# Altium project MB1419.PrjPcb
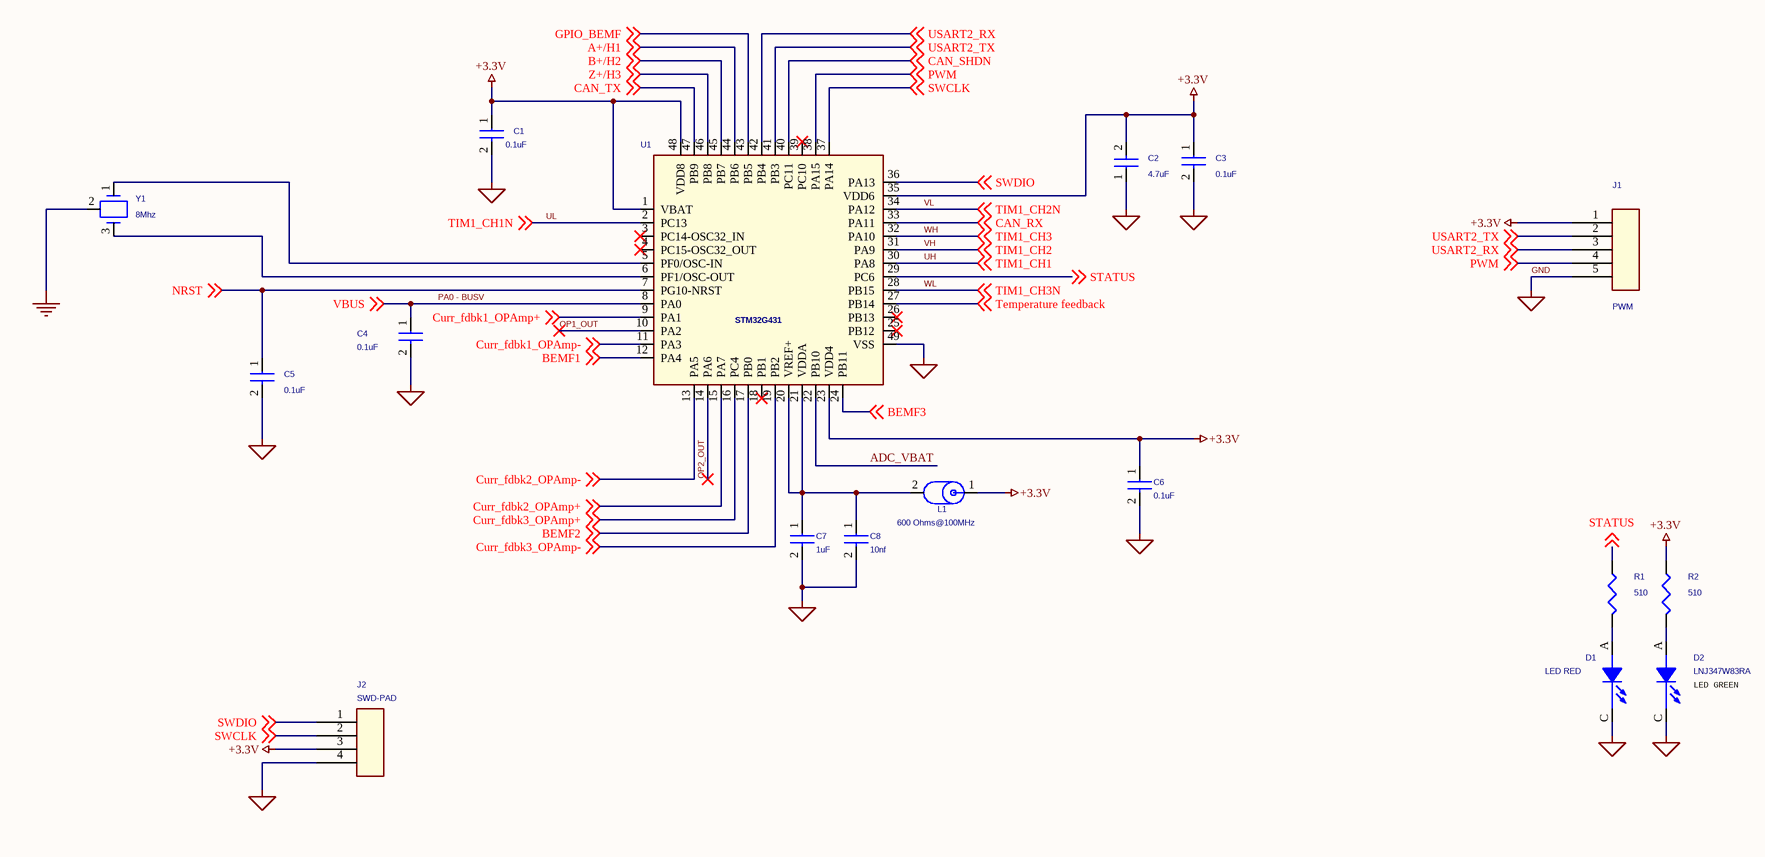
[diagram p0: MCU.SchDoc]
Board_Assembly_Revision: 01; Board_Document_Date: 26-MARCH-2019; Board_Name: ESC_G4; Board_PCB_Revision: B; Board_Reference: MB1419
4 sheets, 121 parts. Net scope: global (net labels, ports and power ports of the same name join across sheets).
Board file: MB1419.PcbDoc
Sheets:
  MCU.SchDoc
  POWER STAGE.SchDoc
  SENSING.SchDoc
  CAN.SchDoc

## Sheet MCU.SchDoc: MVU
size A3; DocumentNumber: 4; SheetNumber: 4; SheetTotal: 6

### Parts
C1  0.1uF  [C_0402]
C2  4.7uF  [C_0603]
C3  0.1uF  [C_0402]
C4  0.1uF  [C_0402]
C5  0.1uF  [C_0402]
C6  0.1uF  [C_0402]
C7  1uF  [C_0402]
C8  10nf  [C_0402]
D1  LED RED  [D_0402_Led_red]
D2  LNJ347W83RA  [D_0402_Led_green]
J1  PWM  [SOLDER_PAD_5PIN_SMD]
J2  SWD-PAD  [SOLDER_PAD_4PIN_rect_SMD]
L1  600 Ohms@100MHz  [L_0402]
R1  510  [R_0402]
R2  510  [R_0402]
U1  STM32G431  [qfn49p50_700x700x60l40x25t560n]
Y1  8Mhz  [murata_cstce8m00g15c99-r0]

### Nets
+3.3V: C1.1 C2.2 C3.1 C6.1 J1.1 J2.3 L1.1 R2.1 U1.1(VBAT) U1.23(VDD4) U1.35(VDD6) U1.48(VDD8)
GND: C1.2 C2.1 C3.2 C4.2 C5.2 C6.2 C7.2 C8.2 D1.C(CATHODE) D2.C(CATHODE) J1.5 J2.4 U1.49(VSS) Y1.2  [also labelled GND_SIGNAL]
A+/H1: U1.44(PB6) ; off-sheet A+/H1
ADC_VBAT: U1.22(PB10)
B+/H2: U1.45(PB7) ; off-sheet B+/H2
BEMF1: U1.12(PA4) ; off-sheet BEMF1
BEMF2: U1.17(PB0) ; off-sheet BEMF2
BEMF3: U1.24(PB11) ; off-sheet BEMF3
CAN_RX: U1.33(PA11) ; off-sheet CAN_RX
CAN_SHDN: U1.40(PC11) ; off-sheet CAN_SHDN
CAN_TX: U1.47(PB9) ; off-sheet CAN_TX
Curr_fdbk1_OPAmp+: U1.9(PA1) ; off-sheet Curr_fdbk1_OPAmp+
Curr_fdbk1_OPAmp-: U1.11(PA3) ; off-sheet Curr_fdbk1_OPAmp-
Curr_fdbk2_OPAmp+: U1.15(PA7) ; off-sheet Curr_fdbk2_OPAmp+
Curr_fdbk2_OPAmp-: U1.13(PA5) ; off-sheet Curr_fdbk2_OPAmp-
Curr_fdbk3_OPAmp+: U1.16(PC4) ; off-sheet Curr_fdbk3_OPAmp+
Curr_fdbk3_OPAmp-: U1.19(PB2) ; off-sheet Curr_fdbk3_OPAmp-
GPIO_BEMF: U1.43(PB5) ; off-sheet GPIO_BEMF
NRST: C5.1 U1.7(PG10-NRST) ; off-sheet NRST
OP1_OUT: U1.10(PA2)
OP2_OUT: U1.14(PA6)
PA0 - BUSV: C4.1 U1.8(PA0) ; off-sheet VBUS  [also labelled VBUS]
PWM: J1.4 U1.38(PA15) ; off-sheet PWM
STATUS: R1.1 U1.29(PC6) ; off-sheet STATUS
SWCLK: J2.2 U1.37(PA14) ; off-sheet SWCLK
SWDIO: J2.1 U1.36(PA13) ; off-sheet SWDIO
Temperature feedback: U1.27(PB14) ; off-sheet Temperature feedback
UH: U1.30(PA8) ; off-sheet TIM1_CH1  [also labelled TIM1_CH1]
UL: U1.2(PC13) ; off-sheet TIM1_CH1N  [also labelled TIM1_CH1N]
USART2_RX: J1.3 U1.42(PB4) ; off-sheet USART2_RX
USART2_TX: J1.2 U1.41(PB3) ; off-sheet USART2_TX
VH: U1.31(PA9) ; off-sheet TIM1_CH2  [also labelled TIM1_CH2]
VL: U1.34(PA12) ; off-sheet TIM1_CH2N  [also labelled TIM1_CH2N]
WH: U1.32(PA10) ; off-sheet TIM1_CH3  [also labelled TIM1_CH3]
WL: U1.28(PB15) ; off-sheet TIM1_CH3N  [also labelled TIM1_CH3N]
Z+/H3: U1.46(PB8) ; off-sheet Z+/H3
NetC7_1: C7.1 C8.1 L1.2 U1.20(VREF+) U1.21(VDDA)
NetD1_A: D1.A(ANODE) R1.2
NetD2_A: D2.A(ANODE) R2.2
NetU1_5: U1.5(PF0/OSC-IN) Y1.1
NetU1_6: U1.6(PF1/OSC-OUT) Y1.3

Not connected (* = marked no-connect by the designer): U1 3(PC14-OSC32_IN)* 4(PC15-OSC32_OUT)* 18(PB1)* 25(PB12)* 26(PB13)* 39(PC10)*

### Notes on the sheet
- (near D2) LED GREEN
- Title:
- Project:
- Size:
- Revision:
- Variant:
- A3
- -
- Date:
- Reference:
- Sheet:
- of

### Library data of the parts
C1 = CAP_Dup1: CAP CER 0.1UF 16V X7R 0402; PART_NUMBER: CAP-00000053; Manufacturer: Wurth Electronics Inc.; Manufacturer PN: 885012205037; Dielectric Type: Capacitors; Tolerance: 10%; CLASS: DISCRETE; Package Size: 0402 (1005 Metric); Temperature Coefficient: X7R; Rated Voltage: 16V
C2 = CAP_Dup1: CAP CER 4.7UF 10V X5R 0603; Manufacturer PN: 885012106012; Manufacturer: Wurth Electronics Inc.; PART_NUMBER: TMP-414; CLASS: DISCRETE; Tolerance: 20%; Dielectric Type: Capacitors; Rated Voltage: 10V; Temperature Coefficient: X5R; Package Size: 0603 (1608 Metric)
C3-C6 = CAP_Dup1: CAP CER 0.1UF 16V X7R 0402; Manufacturer PN: 885012205037; Manufacturer: Wurth Electronics Inc.; PART_NUMBER: CAP-00000053; CLASS: DISCRETE; Tolerance: 10%; Dielectric Type: Capacitors; Rated Voltage: 16V; Temperature Coefficient: X7R; Package Size: 0402 (1005 Metric)
C7 = CAP_Dup1: CAP CER 1UF 25V X5R 0402; PART_NUMBER: CAP-00000006; Manufacturer: Murata Electronics North America; Manufacturer PN: GRM155R61E105KA12D; Dielectric Type: Capacitors; Tolerance: 10%; CLASS: DISCRETE; Package Size: 0402 (1005 Metric); Temperature Coefficient: X5R; Rated Voltage: 25V
C8 = CAP_Dup1: CAP CER 10000PF 16V X7R 0402; PART_NUMBER: TMP-422; Manufacturer: Wurth Electronics Inc.; Manufacturer PN: 885012205031; Dielectric Type: Capacitors; Tolerance: 10%; CLASS: DISCRETE; Package Size: 0402 (1005 Metric); Temperature Coefficient: X7R; Rated Voltage: 16V
D1 = LED: DIO, Rectangle with Flat Top, 1.00mm x 0.50mm, VLMS1500-GS08, 20mA, --, --, 0402 (1005 Metric); PART_NUMBER: DIO-00000003; Manufacturer: Vishay Semiconductor Opto Division; CLASS: DISCRETE; Package Size: 0402 (1005 Metric); Manufacturer PN: VLMS1500-GS08
D2 = LED: LED GREEN 0402 SMD; PART_NUMBER: TMP-187; Manufacturer: Panasonic Electronic Components; CLASS: DISCRETE; Package Size: 0402 (1005 Metric); Manufacturer PN: LNJ347W83RA
J1 = CON5: SOLDER PADS
J2 = CON4: SOLDER PADS
L1 = IND_FB: FERRITE BEAD 600 OHM 0402 1LN; Manufacturer PN: BLM15BX601SN1D; Manufacturer: Murata Electronics North America; PART_NUMBER: TMP-492; CLASS: DISCRETE; Package Size: 0402 (1005 Metric)
R1 R2 = RES: RES SMD 510 OHM 1% 1/16W 0402; PART_NUMBER: TMP-438; Manufacturer: Yageo; Manufacturer PN: RC0402FR-07510RL; Temperature Coefficient: 100ppm/C; Rated Power: 0.063W, 1/16W; CLASS: DISCRETE; Package Size: 0402 (1005 Metric); Tolerance: 1%
U1 = STM32_LQFP64_6
Y1 = resonator: CER RES 8.0000MHZ 33PF SMD; Manufacturer PN: CSTCE8M00G15C99-R0; Manufacturer: Murata Electronics North America; PART_NUMBER: TMP-382; CLASS: DISCRETE; Frequency Tolerance: 0.1%; Frequency Stability: 0.13%; Package Size: 0.126" L x 0.051" W (3.20mm x 1.30mm)

## Sheet POWER STAGE.SchDoc: POWER STAGE
size A3; DocumentNumber: 5; SheetNumber: 5; SheetTotal: 6
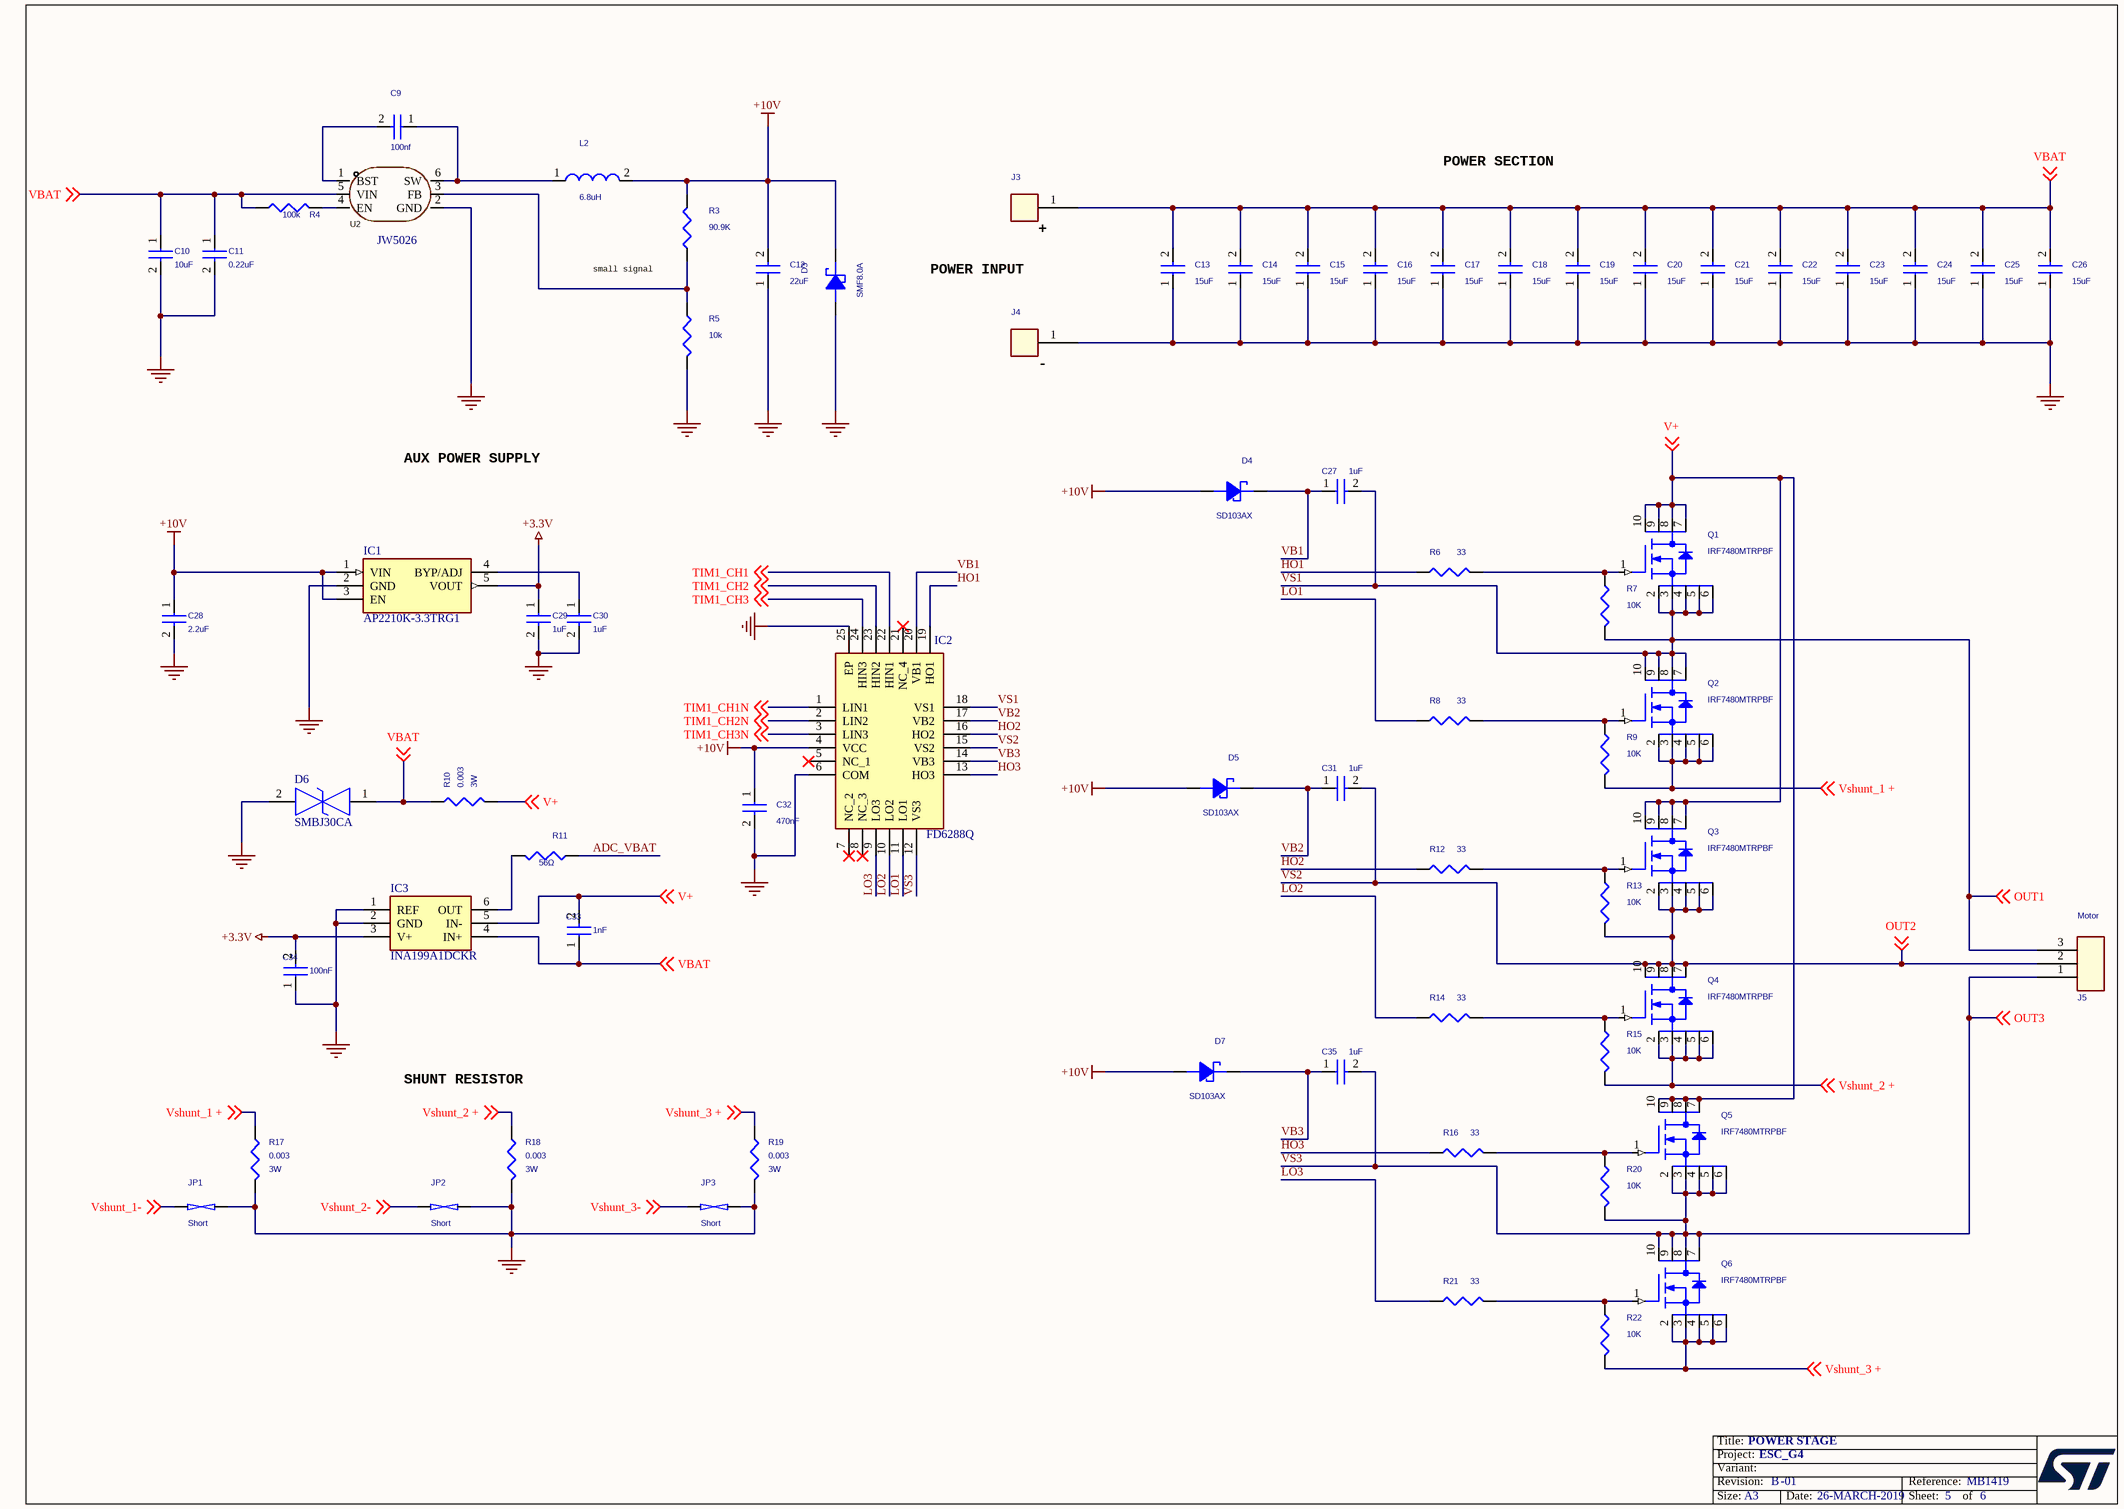
[diagram p1: POWER STAGE.SchDoc]

### Parts
C9  100nf  [C_0402]
C10  10uF  [C_1206]
C11  0.22uF  [C_0603_HD]
C12  22uF  [C_1206]
C13  15uF  [C_0805_HD]
C14  15uF  [C_0805_HD]
C15  15uF  [C_0805_HD]
C16  15uF  [C_0805_HD]
C17  15uF  [C_0805_HD]
C18  15uF  [C_0805_HD]
C19  15uF  [C_0805_HD]
C20  15uF  [C_0805_HD]
C21  15uF  [C_0805_HD]
C22  15uF  [C_0805_HD]
C23  15uF  [C_0805_HD]
C24  15uF  [C_0805_HD]
C25  15uF  [C_0805_HD]
C26  15uF  [C_0805_HD]
C27  1uF  [C_0402]
C28  2.2uF  [C_0402]
C29  1uF  [C_0402]
C30  1uF  [C_0402]
C31  1uF  [C_0402]
C32  470nF  [C_0603_HD]
C33  1nF  [C_0402]
C34  100nF  [C_0402]
C35  1uF  [C_0402]
D3  SMF8.0A  [SODFL3618X108N]
D4  SD103AX  [SODFL1608X70N]
D5  SD103AX  [SODFL1608X70N]
D6  SMBJ30CA  [SMBJ50CA]
D7  SD103AX  [SODFL1608X70N]
IC1  AP2210K-3.3TRG1  [SOT95P280X145-5N]
IC2  FD6288Q  [QFN50P400X400X90-25N-D]
IC3  INA199A1DCKR  [SOT65P210X110-6N]
J3  CON1  [wire1_220s]  (value not drawn)
J4  CON1  [wire1_220s]  (value not drawn)
J5  Motor  [conn_motor_out]
JP1  Short  [SHORT]
JP2  Short  [SHORT]
JP3  Short  [SHORT]
L2  6.8uH  [LQM2MPN1R0NG0L]
Q1  IRF7480MTRPBF  [IRF7480MTRPBF]
Q2  IRF7480MTRPBF  [IRF7480MTRPBF]
Q3  IRF7480MTRPBF  [IRF7480MTRPBF]
Q4  IRF7480MTRPBF  [IRF7480MTRPBF]
Q5  IRF7480MTRPBF  [IRF7480MTRPBF]
Q6  IRF7480MTRPBF  [IRF7480MTRPBF]
R3  90.9K  [R_0402]
R4  100k  [R_0402]
R5  10k  [R_0402]
R6  33  [R_0402]
R7  10K  [R_0402]
R8  33  [R_0402]
R9  10K  [R_0402]
R10  0.003  Rated Power: 3W  [resc635x300x60l193n]
R11  56Ω  [R_0402]
R12  33  [R_0402]
R13  10K  [R_0402]
R14  33  [R_0402]
R15  10K  [R_0402]
R16  33  [R_0402]
R17  0.003  Rated Power: 3W  [resc635x300x60l193n]
R18  0.003  Rated Power: 3W  [resc635x300x60l193n]
R19  0.003  Rated Power: 3W  [resc635x300x60l193n]
R20  10K  [R_0402]
R21  33  [R_0402]
R22  10K  [R_0402]
U2  JW5026  [SOT-23-6_L2.9-W1.6-P0.95-LS2.8-BR]

### Nets
+3.3V: C29.1 C34.2 IC1.5(VOUT) IC3.3(V+)
+10V: C12.2 C28.1 C32.1 D3.C D4.A D5.A D7.A IC1.1(VIN) IC1.3(EN) IC2.4(VCC) L2.2 R3.1
GND: C10.2 C11.2 C12.1 C13.1 C14.1 C15.1 C16.1 C17.1 C18.1 C19.1 C20.1 C21.1 C22.1 C23.1 C24.1 C25.1 C26.1 C28.2 C29.2 C30.2 C32.2 C34.1 D3.A D6.2 IC1.2(GND) IC2.6(COM) IC2.25(EP) IC3.1(REF) IC3.2(GND) J4.1 JP1.2 JP2.2 JP3.2 R5.1 R17.2 R18.2 R19.2 U2.2(GND)
ADC_VBAT: R11.1
HO1: IC2.19(HO1) R6.1
HO2: IC2.16(HO2) R12.1
HO3: IC2.13(HO3) R16.1
LO1: IC2.11(LO1) R8.1
LO2: IC2.10(LO2) R14.1
LO3: IC2.9(LO3) R21.1
TIM1_CH1: IC2.22(HIN1) ; off-sheet TIM1_CH1  [project net UH]
TIM1_CH1N: IC2.1(LIN1) ; off-sheet TIM1_CH1N  [project net UL]
TIM1_CH2: IC2.23(HIN2) ; off-sheet TIM1_CH2  [project net VH]
TIM1_CH2N: IC2.2(LIN2) ; off-sheet TIM1_CH2N  [project net VL]
TIM1_CH3: IC2.24(HIN3) ; off-sheet TIM1_CH3  [project net WH]
TIM1_CH3N: IC2.3(LIN3) ; off-sheet TIM1_CH3N  [project net WL]
V+: C33.2 IC3.5(IN-) Q1.7(D7) Q1.8(D8) Q1.9(D9) Q1.10(D10) Q3.7(D7) Q3.8(D8) Q3.9(D9) Q3.10(D10) Q5.7(D7) Q5.8(D8) Q5.9(D9) Q5.10(D10) R10.2 ; off-sheet V+
VB1: C27.1 D4.C IC2.20(VB1)
VB2: C31.1 D5.C IC2.17(VB2)
VB3: C35.1 D7.C IC2.14(VB3)
VBAT: C10.1 C11.1 C13.2 C14.2 C15.2 C16.2 C17.2 C18.2 C19.2 C20.2 C21.2 C22.2 C23.2 C24.2 C25.2 C26.2 C33.1 D6.1 IC3.4(IN+) J3.1 R4.2 R10.1 U2.5(VIN) ; off-sheet VBAT
VS1: C27.2 IC2.18(VS1) J5.3 Q1.2(S1) Q1.3(S2) Q1.4(S3) Q1.5(S4) Q1.6(S5) Q2.7(D7) Q2.8(D8) Q2.9(D9) Q2.10(D10) R7.2 ; off-sheet OUT1  [also labelled OUT1]
VS2: C31.2 IC2.15(VS2) J5.2 Q3.2(S1) Q3.3(S2) Q3.4(S3) Q3.5(S4) Q3.6(S5) Q4.7(D7) Q4.8(D8) Q4.9(D9) Q4.10(D10) R13.2 ; off-sheet OUT2  [also labelled OUT2]
VS3: C35.2 IC2.12(VS3) J5.1 Q5.2(S1) Q5.3(S2) Q5.4(S3) Q5.5(S4) Q5.6(S5) Q6.7(D7) Q6.8(D8) Q6.9(D9) Q6.10(D10) R20.2 ; off-sheet OUT3  [also labelled OUT3]
Vshunt_1 +: Q2.2(S1) Q2.3(S2) Q2.4(S3) Q2.5(S4) Q2.6(S5) R9.2 R17.1 ; off-sheet Vshunt_1 +
Vshunt_1-: JP1.1 ; off-sheet Vshunt_1-  [project net Curr_fdbk1_OPAmp-]
Vshunt_2 +: Q4.2(S1) Q4.3(S2) Q4.4(S3) Q4.5(S4) Q4.6(S5) R15.2 R18.1 ; off-sheet Vshunt_2 +
Vshunt_2-: JP2.1 ; off-sheet Vshunt_2-  [project net Curr_fdbk2_OPAmp-]
Vshunt_3 +: Q6.2(S1) Q6.3(S2) Q6.4(S3) Q6.5(S4) Q6.6(S5) R19.1 R22.2 ; off-sheet Vshunt_3 +
Vshunt_3-: JP3.1 ; off-sheet Vshunt_3-  [project net Curr_fdbk3_OPAmp-]
NetC9_1: C9.1 L2.1 U2.6(SW)
NetC9_2: C9.2 U2.1(BST)
NetC30_1: C30.1 IC1.4(BYP/ADJ)
NetIC3_6: IC3.6(OUT) R11.2
NetQ1_1: Q1.1(G) R6.2 R7.1
NetQ2_1: Q2.1(G) R8.2 R9.1
NetQ3_1: Q3.1(G) R12.2 R13.1
NetQ4_1: Q4.1(G) R14.2 R15.1
NetQ5_1: Q5.1(G) R16.2 R20.1
NetQ6_1: Q6.1(G) R21.2 R22.1
NetR3_2: R3.2 R5.2 U2.3(FB)
NetR4_1: R4.1 U2.4(EN)

Not connected (* = marked no-connect by the designer): IC2 5(NC_1)* 7(NC_2)* 8(NC_3)* 21(NC_4)*

### Notes on the sheet
- POWER SECTION
- (near J3) +
- small signal
- POWER INPUT
- (near J4) -
- AUX POWER SUPPLY
- (near R18) SHUNT RESISTOR
- Title:
- Project:
- Size:
- Revision:
- Variant:
- A3
- Date:
- Reference:
- Sheet:
- of

### Library data of the parts
C9 = CAP_Dup1: CAP CER 3900PF 16V X7R 0402; Manufacturer PN: C0402C392K4RAC7867; Manufacturer: KEMET; PART_NUMBER: TMP-419; CLASS: DISCRETE; Tolerance: 10%; Dielectric Type: Capacitors; Rated Voltage: 16V; Temperature Coefficient: X7R; Package Size: 0402 (1005 Metric)
C10 = CAP_Dup1: CAP CER 10UF 50V X7R 1206; Manufacturer PN: CL31B106KBHNNNE; Manufacturer: Samsung Electro-Mechanics America, Inc.; PART_NUMBER: CAP-00000016; CLASS: DISCRETE; Tolerance: 10%; Dielectric Type: Capacitors; Rated Voltage: 50V; Temperature Coefficient: X7R; Package Size: 1206 (3216 Metric)
C11 = CAP_Dup1: CAP CER 0.22UF 50V X7R 0603; Manufacturer PN: CGA3E3X7R1H224K080AD; Manufacturer: TDK Corporation; PART_NUMBER: TMP-138; CLASS: DISCRETE; Tolerance: 10%; Dielectric Type: Capacitors; Rated Voltage: 50V; Temperature Coefficient: X7R; Package Size: 0603 (1608 Metric); ALT_SYMBOLS: c_0603_hd
C12 = CAP_Dup1: CAP CER 22UF 25V X5R 1206; Manufacturer PN: GRT31CR61E226ME01L; Manufacturer: Murata Electronics North America; PART_NUMBER: TMP-421; CLASS: DISCRETE; Tolerance: 20%; Dielectric Type: Capacitors; Rated Voltage: 25V; Temperature Coefficient: X5R; Package Size: 1206 (3216 Metric)
C13-C26 = CAP_Dup1: CAP CER 15UF 35V X5R 0805; PART_NUMBER: TMP-773; Manufacturer: TDK Corporation; Manufacturer PN: C2012X5R1V156M125AC; Dielectric Type: Capacitors; Tolerance: 20%; CLASS: DISCRETE; ALT_SYMBOLS: C_0805_hd; Package Size: 0805 (2012 Metric); Temperature Coefficient: X5R; Rated Voltage: 35V
C27 C31 C33-C35 = CAP: CAP CER 10PF 10V C0G/NP0 0402; Manufacturer PN: 885012005007; Manufacturer: Wurth Electronics Inc.; PART_NUMBER: TMP-395; CLASS: DISCRETE; Tolerance: 5%; Temperature Coefficient: C0G, NP0; Dielectric Type: Capacitors; Rated Voltage: 10V; Package Size: 0402 (1005 Metric)
C28 = CAP_Dup1: CAP CER 2.2UF 10V X5R 0402; PART_NUMBER: TMP-449; Manufacturer: Wurth Electronics Inc.; Manufacturer PN: 885012105013; Dielectric Type: Capacitors; Tolerance: 20%; CLASS: DISCRETE; Package Size: 0402 (1005 Metric); Temperature Coefficient: X5R; Rated Voltage: 10V
C29 C30 = CAP_Dup1: CAP CER 1UF 25V X5R 0402; Manufacturer PN: GRM155R61E105KA12D; Manufacturer: Murata Electronics North America; PART_NUMBER: CAP-00000006; CLASS: DISCRETE; Tolerance: 10%; Dielectric Type: Capacitors; Rated Voltage: 25V; Temperature Coefficient: X5R; Package Size: 0402 (1005 Metric)
C32 = CAP_Dup1: CAP CER 0.47UF 25V X7R 0603; PART_NUMBER: TMP-428; Manufacturer: Wurth Electronics Inc.; Manufacturer PN: 885012206075; Dielectric Type: Capacitors; Tolerance: 10%; CLASS: DISCRETE; ALT_SYMBOLS: c_0603_hd; Package Size: 0603 (1608 Metric); Temperature Coefficient: X7R; Rated Voltage: 25V
D3 = DIODE_SCHOTTKY_0: DIODE SCHOTTKY 20V 1A STMITEFLAT; PART_NUMBER: TMP-380; Manufacturer: STMicroelectronics; Manufacturer PN: STPS1L20MF; Rated Voltage: 430mV @ 1A; CLASS: DISCRETE; Package Size: DO-222AA
D4 D5 D7 = DIODE_SCHOTTKY_0: DIODE SCHOTTKY 20V 1A STMITEFLAT; Manufacturer PN: STPS1L20MF; Manufacturer: STMicroelectronics; PART_NUMBER: TMP-380; CLASS: DISCRETE; Rated Voltage: 430mV @ 1A; Package Size: DO-222AA
D6 = SMBJ30CA: TVS Diode (Bi-directional); Manufacturer_Name: STMicroelectronics; Datasheet Link: http://www.st.com/web/en/resource/technical/document/datasheet/CD00001366.pdf; Height: 2.65mm; Manufacturer_Part_Number: SMBJ30CA
IC1 = AP2210K-3.3TRG1: Integrated Circuit; Manufacturer_Name: Diodes Inc.; Datasheet Link: https://datasheet.datasheetarchive.com/originals/distributors/Datasheets_SAMA/11c7b06ddc65ce3f1395e62eca004054.pdf; Height: 1.45mm; Manufacturer_Part_Number: AP2210K-3.3TRG1; Mouser Part Number: 621-AP2210K-3.3TRG1; Mouser Price/Stock: https://www.mouser.co.uk/ProductDetail/Diodes-Incorporated/AP2210K-3.3TRG1?qs=x6A8l6qLYDB6QE%252Bu0QG50A%3D%3D; Arrow Part Number: AP2210K-3.3TRG1; Arrow Price/Stock: https://www.arrow.com/en/products/ap2210k-3.3trg1/diodes-incorporated?region=asia
IC2 = FD6288Q: Integrated Circuit; Manufacturer_Name: Fortior Tech; Datasheet Link: https://datasheet.lcsc.com/szlcsc/1811131655_Fortior-Tech-FD6288Q_C328453.pdf; Height: 0.9mm; Manufacturer_Part_Number: FD6288Q
IC3 = INA199A1DCKR: Integrated Circuit; Manufacturer_Name: Texas Instruments; Datasheet Link: http://www.ti.com/lit/ds/symlink/ina199.pdf; Height: 1.1mm; Manufacturer_Part_Number: INA199A1DCKR; Mouser Part Number: 595-INA199A1DCKR; Mouser Price/Stock: https://www.mouser.co.uk/ProductDetail/Texas-Instruments/INA199A1DCKR?qs=v3hU%2FV0XOahkyIKIBScY5Q%3D%3D; Arrow Part Number: INA199A1DCKR; Arrow Price/Stock: https://www.arrow.com/en/products/ina199a1dckr/texas-instruments?region=nac
J3 J4 = CON1: SOLDER PADS
J5 = CON3: SOLDER PADS
JP1-JP3 = SHORT: 2 PIN SHORTED TO CONNECT DIFFERENT NETS; PART_NUMBER: TMP-442; CLASS: DISCRETE
L2 = IND: Fixed Inductors LPS4018 Low Profile 33uH 0.8A 20% SMD; Manufacturer PN: LPS4018-333MRB; Manufacturer: Coilcraft; PART_NUMBER: TMP-377; CLASS: DISCRETE; Tolerance: 20%; Package Size: 3.9x3.9x1.7
Q1-Q6 = MOSFET_N: N-channel 60 V, 1.9 mO typ., 120 A STripFET™ F7; PART_NUMBER: TMP-772; Manufacturer: STMicroelectronics; Manufacturer PN: STL180N6F7; CLASS: DISCRETE; Rated Voltage: 60V; Package Size: PowerFLAT 5x6
R3 = RES: RES SMD 4.7K OHM 1% 1/16W 0402; Manufacturer PN: CRG0402F4K7; Manufacturer: TE Connectivity Passive Product; PART_NUMBER: TMP-403; CLASS: DISCRETE; Rated Power: 0.063W, 1/16W; Temperature Coefficient: 100ppm/C; Tolerance: 1%; Package Size: 0402 (1005 Metric)
R4 = RES: RES SMD 34.8K OHM 1% 1/16W 0402; Manufacturer PN: RC0402FR-0734K8L; Manufacturer: Yageo; PART_NUMBER: TMP-415; CLASS: DISCRETE; Rated Power: 0.063W, 1/16W; Temperature Coefficient: 100ppm/C; Tolerance: 1%; Package Size: 0402 (1005 Metric)
R5 = RES: RES SMD 300 OHM 1% 1/16W 0402; PART_NUMBER: TMP-418; Manufacturer: Yageo; Manufacturer PN: RC0402FR-07300RL; Temperature Coefficient: 100ppm/C; Rated Power: 0.063W, 1/16W; CLASS: DISCRETE; Package Size: 0402 (1005 Metric); Tolerance: 1%
R6 R8 R12 R14 R16 R21 = RES: RES SMD 33 OHM 1% 1/16W 0402; PART_NUMBER: TMP-441; Manufacturer: Yageo; Manufacturer PN: RC0402FR-07120RL; Temperature Coefficient: 100ppm/C; Rated Power: 0.063W, 1/16W; CLASS: DISCRETE; Package Size: 0402 (1005 Metric); Tolerance: 1%
R7 R9 R13 R15 = RES: RES SMD 10K OHM 1% 1/16W 0402; Manufacturer PN: RC0402FR-0710KL; Manufacturer: Yageo; PART_NUMBER: TMP-396; CLASS: DISCRETE; Rated Power: 0.063W, 1/16W; Temperature Coefficient: 100ppm/C; Tolerance: 1%; Package Size: 0402 (1005 Metric)
R10 R18 = RES: RES 0.003 OHM 1% 3W 2512; Manufacturer PN: TLR3A30DR003FTDG; Manufacturer: TE Connectivity Passive Product; PART_NUMBER: TMP-766; CLASS: DISCRETE; Temperature Coefficient: 50ppm/C; Tolerance: 1%; Package Size: 2512 (6432 Metric)
R11 = RES: RES SMD 30.9K OHM 1% 1/10W 0402; PART_NUMBER: TMP-448; Manufacturer: Panasonic Electronic Components; Manufacturer PN: ERJ-2RKF3092X; Temperature Coefficient: 100ppm/C; Rated Power: 0.1W, 1/10W; CLASS: DISCRETE; Package Size: 0402 (1005 Metric); Tolerance: 1%
R17 R19 = RES: RES 0.003 OHM 1% 3W 2512; PART_NUMBER: TMP-766; Manufacturer: TE Connectivity Passive Product; Manufacturer PN: TLR3A30DR003FTDG; Temperature Coefficient: 50ppm/C; CLASS: DISCRETE; Package Size: 2512 (6432 Metric); Tolerance: 1%
R20 R22 = RES: RES SMD 10K OHM 1% 1/16W 0402; PART_NUMBER: TMP-396; Manufacturer: Yageo; Manufacturer PN: RC0402FR-0710KL; Temperature Coefficient: 100ppm/C; Rated Power: 0.063W, 1/16W; CLASS: DISCRETE; Package Size: 0402 (1005 Metric); Tolerance: 1%
U2 = JW5026: Manufacturer: Joulwatt(杰华特); Add into BOM: yes; Function: 降压型; Name: JW5026; Symbol: JW5026; Device: JW5026; LCSC Part Name: 降压型; Supplier Part: C185109; Manufacturer Part: JW5026; Supplier Footprint: SOT-23-6; JLCPCB Part Class: Extended Part; Datasheet: https://atta.szlcsc.com/upload/public/pdf/source/20180404/C185109_F816213DAA4C443FF7F4B914D7806D86.pdf; Supplier: LCSC; Convert to PCB: yes; Synchronous Rectification: -; Number of Outputs: -; Topology: -; Input Voltage: -; Output Current (Max): -; Switching Frequency: -

## Sheet SENSING.SchDoc: SENSING
size A3; DocumentNumber: 6; SheetNumber: 6; SheetTotal: 6
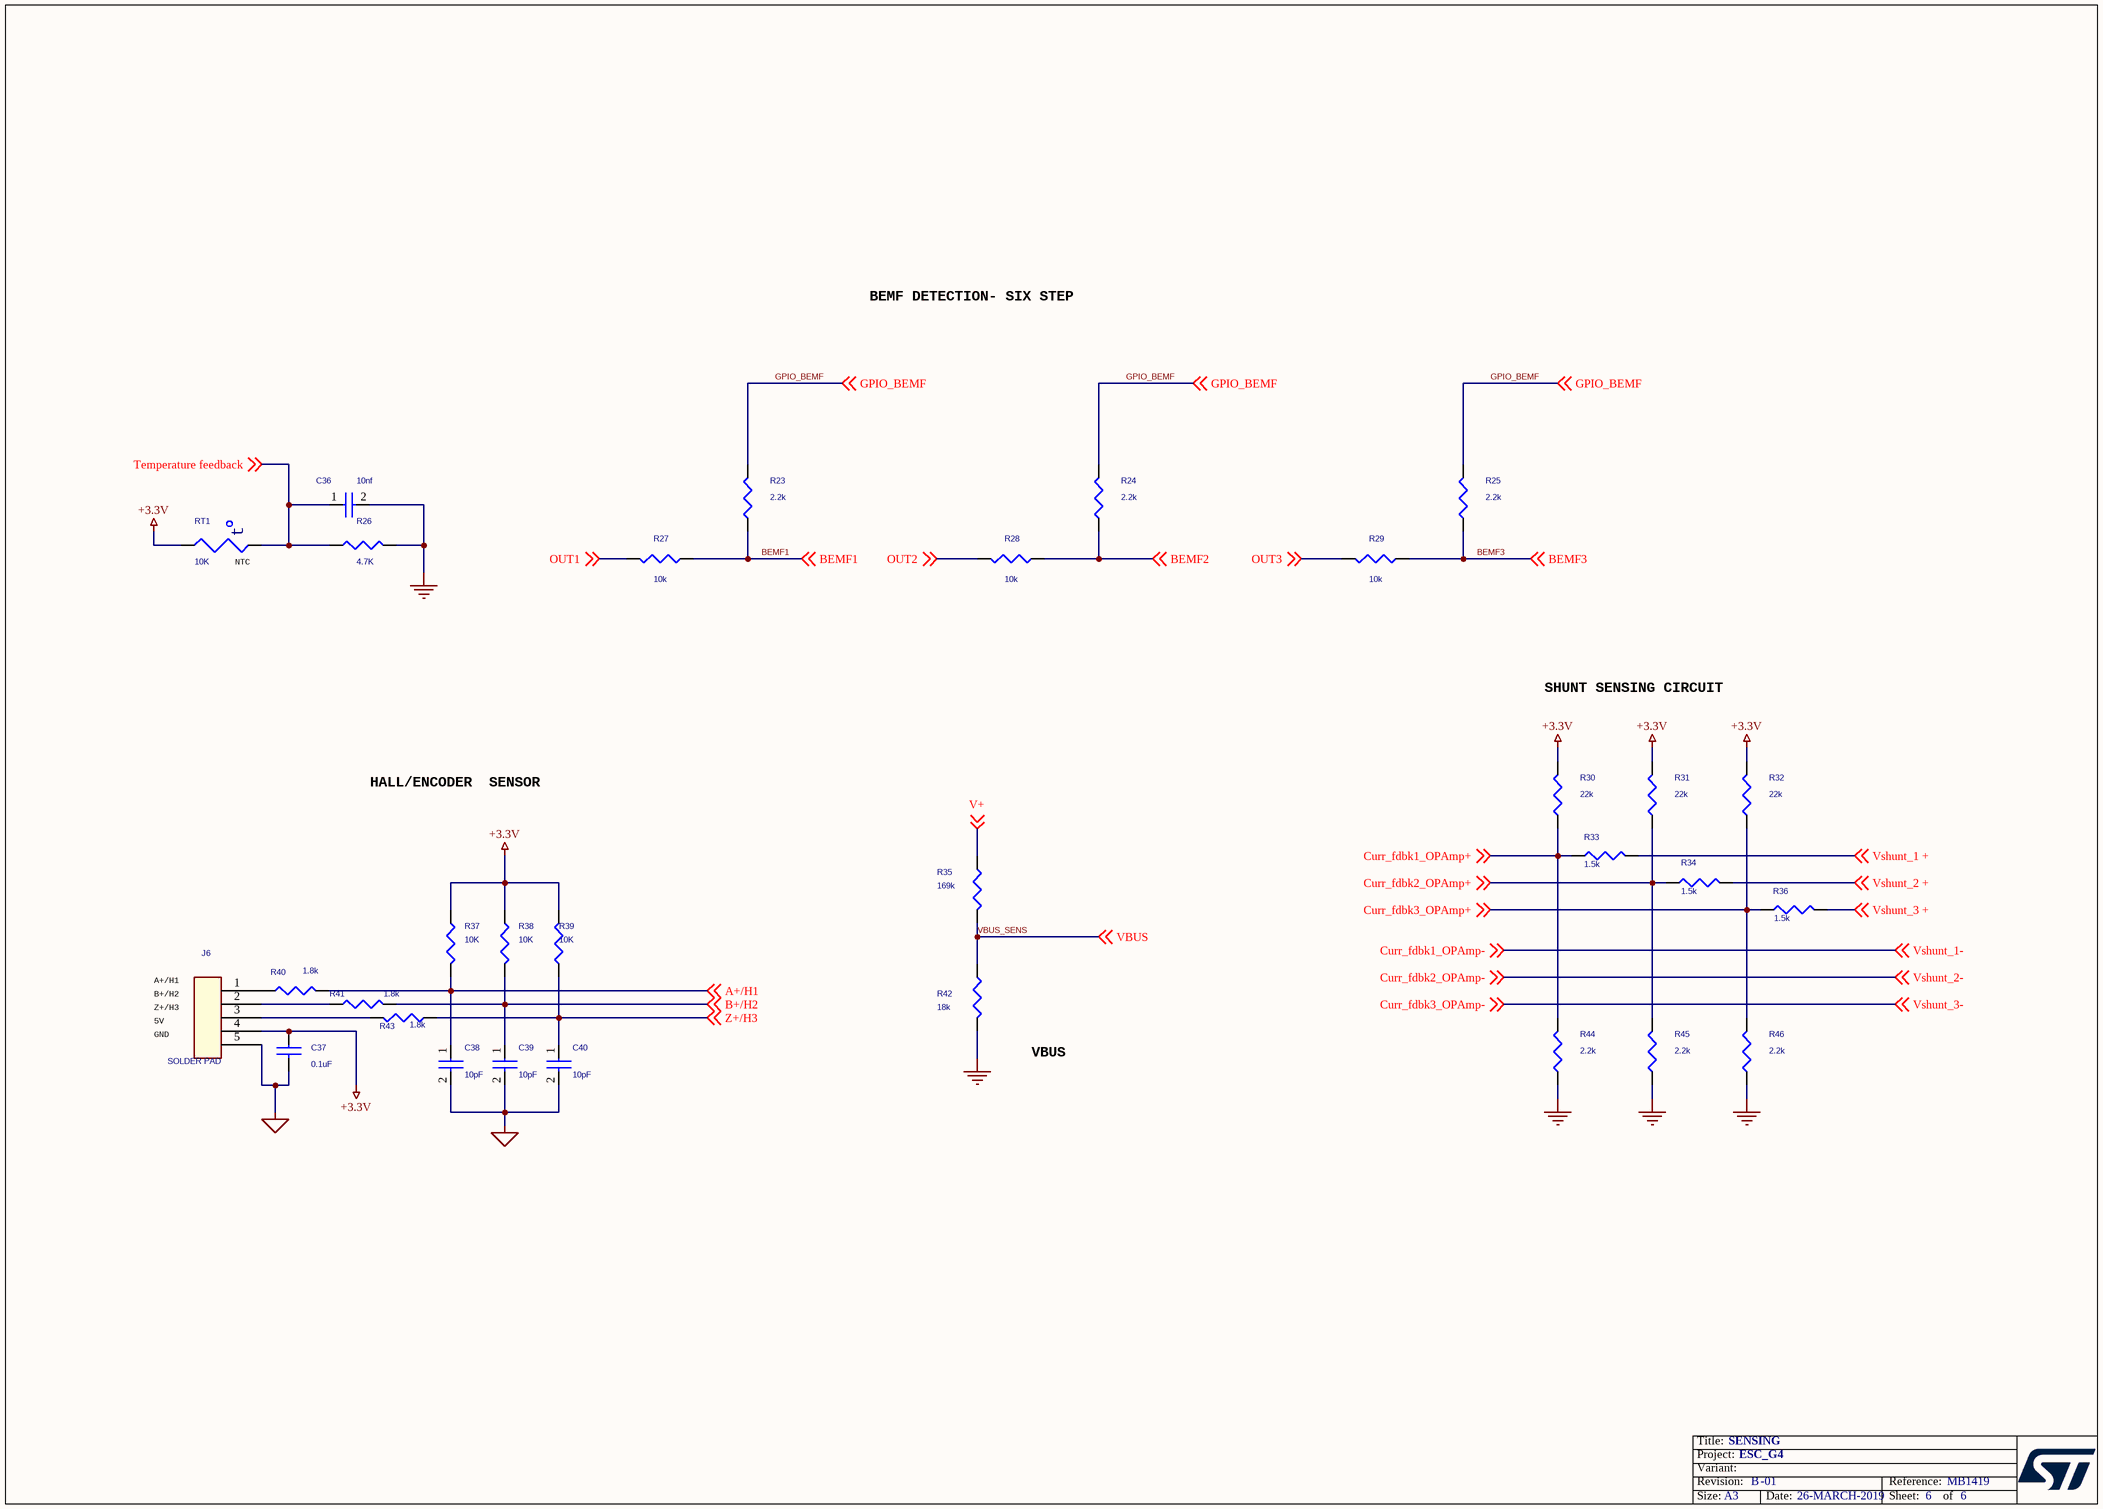
[diagram p2: SENSING.SchDoc]

### Parts
C36  10nf  [C_0402]
C37  0.1uF  [C_0402]
C38  10pF  [C_0402]
C39  10pF  [C_0402]
C40  10pF  [C_0402]
J6  SOLDER PAD  [SOLDER_PAD_5PIN_SMD]
R23  2.2k  [R_0402]
R24  2.2k  [R_0402]
R25  2.2k  [R_0402]
R26  4.7K  [R_0402]
R27  10k  [R_0402]
R28  10k  [R_0402]
R29  10k  [R_0402]
R30  22k  [r_0402]
R31  22k  [r_0402]
R32  22k  [r_0402]
R33  1.5k  [R_0402]
R34  1.5k  [R_0402]
R35  169k  [R_0402]
R36  1.5k  [R_0402]
R37  10K  [R_0402]
R38  10K  [R_0402]
R39  10K  [R_0402]
R40  1.8k  [R_0402]
R41  1.8k  [R_0402]
R42  18k  [R_0402]
R43  1.8k  [R_0402]
R44  2.2k  [R_0402]
R45  2.2k  [R_0402]
R46  2.2k  [R_0402]
RT1  10K  [R_0402]

### Nets
+3.3V: C37.1 J6.4 R30.2 R31.2 R32.2 R37.1 R38.1 R39.2 RT1.1
GND: C36.2 C37.2 C38.2 C39.2 C40.2 J6.5 R26.2 R42.2 R44.1 R45.1 R46.1  [also labelled GND_SIGNAL]
A+/H1: C38.1 R37.2 R40.2 ; off-sheet A+/H1
B+/H2: C39.1 R38.2 R41.2 ; off-sheet B+/H2
BEMF1: R23.1 R27.1 ; off-sheet BEMF1
BEMF2: R24.1 R28.1 ; off-sheet BEMF2
BEMF3: R25.1 R29.1 ; off-sheet BEMF3
Curr_fdbk1_OPAmp+: R30.1 R33.1 R44.2 ; off-sheet Curr_fdbk1_OPAmp+
Curr_fdbk1_OPAmp-: off-sheet Curr_fdbk1_OPAmp-, off-sheet Vshunt_1-  [also labelled Vshunt_1-]
Curr_fdbk2_OPAmp+: R31.1 R34.1 R45.2 ; off-sheet Curr_fdbk2_OPAmp+
Curr_fdbk2_OPAmp-: off-sheet Curr_fdbk2_OPAmp-, off-sheet Vshunt_2-  [also labelled Vshunt_2-]
Curr_fdbk3_OPAmp+: R32.1 R36.1 R46.2 ; off-sheet Curr_fdbk3_OPAmp+
Curr_fdbk3_OPAmp-: off-sheet Curr_fdbk3_OPAmp-, off-sheet Vshunt_3-  [also labelled Vshunt_3-]
GPIO_BEMF: R23.2 R24.2 R25.2 ; off-sheet GPIO_BEMF
OUT1: R27.2 ; off-sheet OUT1  [project net VS1]
OUT2: R28.2 ; off-sheet OUT2  [project net VS2]
OUT3: R29.2 ; off-sheet OUT3  [project net VS3]
Temperature feedback: C36.1 R26.1 RT1.2 ; off-sheet Temperature feedback
V+: R35.1 ; off-sheet V+
VBUS: R35.2 R42.1 ; off-sheet VBUS  [also labelled VBUS_SENS]  [project net PA0 - BUSV]
Vshunt_1 +: R33.2 ; off-sheet Vshunt_1 +
Vshunt_2 +: R34.2 ; off-sheet Vshunt_2 +
Vshunt_3 +: R36.2 ; off-sheet Vshunt_3 +
Z+/H3: C40.1 R39.1 R43.1 ; off-sheet Z+/H3
NetJ6_1: J6.1 R40.1
NetJ6_2: J6.2 R41.1
NetJ6_3: J6.3 R43.2

### Notes on the sheet
- BEMF DETECTION- SIX STEP
- (near RT1) NTC
- SHUNT SENSING CIRCUIT
- HALL/ENCODER  SENSOR
- (near J6) A+/H1
- 5V
- (near J6) Z+/H3
- (near J6) B+/H2
- GND
- VBUS
- Title:
- Project:
- Size:
- Revision:
- Variant:
- A3
- -
- Date:
- Reference:
- Sheet:
- of
- (in symbol NTC) t

### Library data of the parts
C36 = CAP_Dup1: CAP CER 10000PF 10V X7R 0402; PART_NUMBER: CAP-00000003; Manufacturer: Wurth Electronics Inc.; Manufacturer PN: 885012205012; Dielectric Type: Capacitors; Tolerance: 10%; CLASS: DISCRETE; Package Size: 0402 (1005 Metric); Temperature Coefficient: X7R; Rated Voltage: 10V
C37 = CAP_4: CAP CER 0.1UF 16V X7R 0402; Manufacturer PN: 885012205037; Manufacturer: Wurth Electronics Inc.; PART_NUMBER: CAP-00000053; CLASS: DISCRETE; Tolerance: 10%; Dielectric Type: Capacitors; Rated Voltage: 16V; Temperature Coefficient: X7R; Package Size: 0402 (1005 Metric)
C38-C40 = CAP: as C27 on sheet POWER STAGE; Rated Voltage: 10V; Package Size: 0402 (1005 Metric)
J6 = CON5: SOLDER PADS
R23-R25 R27-R29 = RES: RES SMD 2.2K OHM 1% 1/16W 0402; Manufacturer PN: RC0402FR-072K2L; Manufacturer: Yageo; PART_NUMBER: TMP-444; CLASS: DISCRETE; Rated Power: 0.063W, 1/16W; Temperature Coefficient: 100ppm/C; Tolerance: 1%; Package Size: 0402 (1005 Metric)
R26 = RES: RES SMD 4.7K OHM 1% 1/16W 0402; PART_NUMBER: TMP-403; Manufacturer: TE Connectivity Passive Product; Manufacturer PN: CRG0402F4K7; Temperature Coefficient: 100ppm/C; Rated Power: 0.063W, 1/16W; CLASS: DISCRETE; Package Size: 0402 (1005 Metric); Tolerance: 1%
R30-R32 = RES: RES SMD 22K OHM 1% 1/10W 0402; PART_NUMBER: TMP-751; Manufacturer: Panasonic Electronic Components; Manufacturer PN: ERJ-2RKF2202X; Temperature Coefficient: 100ppm/C; Rated Power: 0.1W, 1/10W; CLASS: DISCRETE; Package Size: 0402 (1005 Metric); Tolerance: 1%
R33 R34 R36 = RES: RES SMD 1.5K OHM 1% 1/16W 0402; PART_NUMBER: TMP-393; Manufacturer: Yageo; Manufacturer PN: RC0402FR-071K5L; Temperature Coefficient: 100ppm/C; Rated Power: 0.063W, 1/16W; CLASS: DISCRETE; Package Size: 0402 (1005 Metric); Tolerance: 1%
R35 = RES: RES SMD 169K OHM 1% 1/16W 0402; PART_NUMBER: TMP-424; Manufacturer: Yageo; Manufacturer PN: RC0402FR-07169KL; Temperature Coefficient: 100ppm/C; Rated Power: 0.063W, 1/16W; CLASS: DISCRETE; Package Size: 0402 (1005 Metric); Tolerance: 1%
R37 = RES: as R20 on sheet POWER STAGE; Package Size: 0402 (1005 Metric); Tolerance: 1%
R38 R39 = RES: as R7 on sheet POWER STAGE; Tolerance: 1%; Package Size: 0402 (1005 Metric)
R40 = RES: RES SMD 1.8K OHM 1% 1/16W 0402; Manufacturer PN: RC0402FR-071K8L; Manufacturer: Yageo; PART_NUMBER: TMP-394; CLASS: DISCRETE; Rated Power: 0.063W, 1/16W; Temperature Coefficient: 100ppm/C; Tolerance: 1%; Package Size: 0402 (1005 Metric)
R41 R43 = RES: RES SMD 1.8K OHM 1% 1/16W 0402; PART_NUMBER: TMP-394; Manufacturer: Yageo; Manufacturer PN: RC0402FR-071K8L; Temperature Coefficient: 100ppm/C; Rated Power: 0.063W, 1/16W; CLASS: DISCRETE; Package Size: 0402 (1005 Metric); Tolerance: 1%
R42 = RES: RES SMD 18K OHM 1% 1/16W 0402; PART_NUMBER: TMP-425; Manufacturer: Yageo; Manufacturer PN: RC0402FR-0718KL; Temperature Coefficient: 100ppm/C; Rated Power: 0.063W, 1/16W; CLASS: DISCRETE; Package Size: 0402 (1005 Metric); Tolerance: 1%
R44-R46 = RES: RES SMD 2.2K OHM 1% 1/16W 0402; PART_NUMBER: TMP-444; Manufacturer: Yageo; Manufacturer PN: RC0402FR-072K2L; Temperature Coefficient: 100ppm/C; Rated Power: 0.063W, 1/16W; CLASS: DISCRETE; Package Size: 0402 (1005 Metric); Tolerance: 1%
RT1 = NTC: NTC THERMISTOR 10K OHM 1% 0402; Manufacturer PN: NTCG103JF103FT1; Manufacturer: TDK Corporation; PART_NUMBER: TMP-423; CLASS: DISCRETE; Package Size: 0402 (1005 Metric)

## Sheet CAN.SchDoc: CAN
size A4; DocumentNumber: 2; SheetNumber: 2; SheetTotal: 6
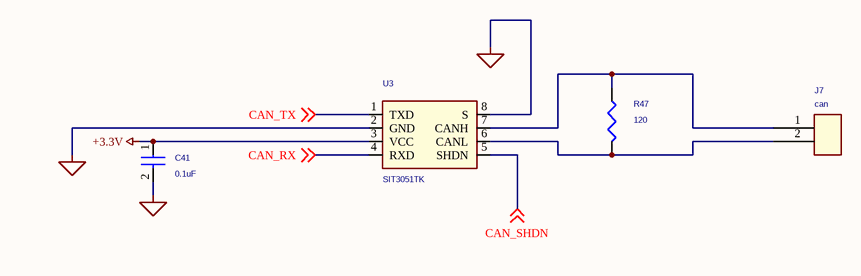
[diagram p3: CAN.SchDoc]

### Parts
C41  0.1uF  [C_0402]
J7  can  [SOLDER_PAD_2PIN_SMD]
R47  120  [R_0402]
U3  SIT3051TK  [sot23-8p65_280x145l45x30n]

### Nets
+3.3V: C41.1 U3.3(VCC)
GND_SIGNAL: C41.2 U3.2(GND) U3.8(S)  [project net GND]
CAN_RX: U3.4(RXD) ; off-sheet CAN_RX
CAN_SHDN: U3.5(SHDN) ; off-sheet CAN_SHDN
CAN_TX: U3.1(TXD) ; off-sheet CAN_TX
NetJ7_1: J7.1 R47.1 U3.7(CANH)
NetJ7_2: J7.2 R47.2 U3.6(CANL)

### Notes on the sheet
- Title:
- Project:
- Size:
- Revision:
- Variant:
- A4
- -
- Date:
- Reference:
- Sheet:
- of

### Library data of the parts
C41 = CAP_Dup1: as C1 on sheet MCU; Package Size: 0402 (1005 Metric); Temperature Coefficient: X7R; Rated Voltage: 16V
J7 = CON4_3: SOLDER PADS
R47 = RES: RES SMD 120 OHM 1% 1/16W 0402; PART_NUMBER: TMP-441; Manufacturer: Yageo; Manufacturer PN: RC0402FR-07120RL; Temperature Coefficient: 100ppm/C; Rated Power: 0.063W, 1/16W; CLASS: DISCRETE; Package Size: 0402 (1005 Metric); Tolerance: 1%
U3 = TCAN330: IC TXRX CAN 3.3V SOT-23; PART_NUMBER: TMP-379; Manufacturer: Texas Instruments; Manufacturer PN: TCAN330DCNT; Supply Voltage: 3 V ~ 3.6 V; Package Size: SOT-23-8; CLASS: IC

## Nets that join several sheets
+3.3V: MCU (12 pins), POWER STAGE (C29.1 C34.2 IC1.5 IC3.3), SENSING (9 pins), CAN (C41.1 U3.3)
GND: MCU (14 pins), POWER STAGE (38 pins), SENSING (11 pins), CAN (C41.2 U3.2 U3.8)
A+/H1: MCU (U1.44), SENSING (C38.1 R37.2 R40.2)
ADC_VBAT: MCU (U1.22), POWER STAGE (R11.1)
B+/H2: MCU (U1.45), SENSING (C39.1 R38.2 R41.2)
BEMF1: MCU (U1.12), SENSING (R23.1 R27.1)
BEMF2: MCU (U1.17), SENSING (R24.1 R28.1)
BEMF3: MCU (U1.24), SENSING (R25.1 R29.1)
CAN_RX: MCU (U1.33), CAN (U3.4)
CAN_SHDN: MCU (U1.40), CAN (U3.5)
CAN_TX: MCU (U1.47), CAN (U3.1)
Curr_fdbk1_OPAmp+: MCU (U1.9), SENSING (R30.1 R33.1 R44.2)
Curr_fdbk1_OPAmp-: MCU (U1.11), POWER STAGE (JP1.1)
Curr_fdbk2_OPAmp+: MCU (U1.15), SENSING (R31.1 R34.1 R45.2)
Curr_fdbk2_OPAmp-: MCU (U1.13), POWER STAGE (JP2.1)
Curr_fdbk3_OPAmp+: MCU (U1.16), SENSING (R32.1 R36.1 R46.2)
Curr_fdbk3_OPAmp-: MCU (U1.19), POWER STAGE (JP3.1)
GPIO_BEMF: MCU (U1.43), SENSING (R23.2 R24.2 R25.2)
PA0 - BUSV: MCU (C4.1 U1.8), SENSING (R35.2 R42.1)
Temperature feedback: MCU (U1.27), SENSING (C36.1 R26.1 RT1.2)
UH: MCU (U1.30), POWER STAGE (IC2.22)
UL: MCU (U1.2), POWER STAGE (IC2.1)
V+: POWER STAGE (15 pins), SENSING (R35.1)
VH: MCU (U1.31), POWER STAGE (IC2.23)
VL: MCU (U1.34), POWER STAGE (IC2.2)
VS1: POWER STAGE (13 pins), SENSING (R27.2)
VS2: POWER STAGE (13 pins), SENSING (R28.2)
VS3: POWER STAGE (13 pins), SENSING (R29.2)
Vshunt_1 +: POWER STAGE (7 pins), SENSING (R33.2)
Vshunt_2 +: POWER STAGE (7 pins), SENSING (R34.2)
Vshunt_3 +: POWER STAGE (7 pins), SENSING (R36.2)
WH: MCU (U1.32), POWER STAGE (IC2.24)
WL: MCU (U1.28), POWER STAGE (IC2.3)
Z+/H3: MCU (U1.46), SENSING (C40.1 R39.1 R43.1)

## Assembly variants
G431CBU6: not fitted C12 J1 J2 J3 J4 J5 J6 J7 J8 JP1 JP2 JP3 R17 TP1 TP2 TP3